# EasyEDA Pro project SimGEKI2_CardReader.epro

# Schematic CardReader
Board Name: CardReader; Create Date: 2023-11-30; Page Name: P1; Project Name: ongeki-controller; Schematic Name: CardReader; Update Date: 2025-03-11; Company: 嘉立创EDA; Page Size: A4; Version: v1.9
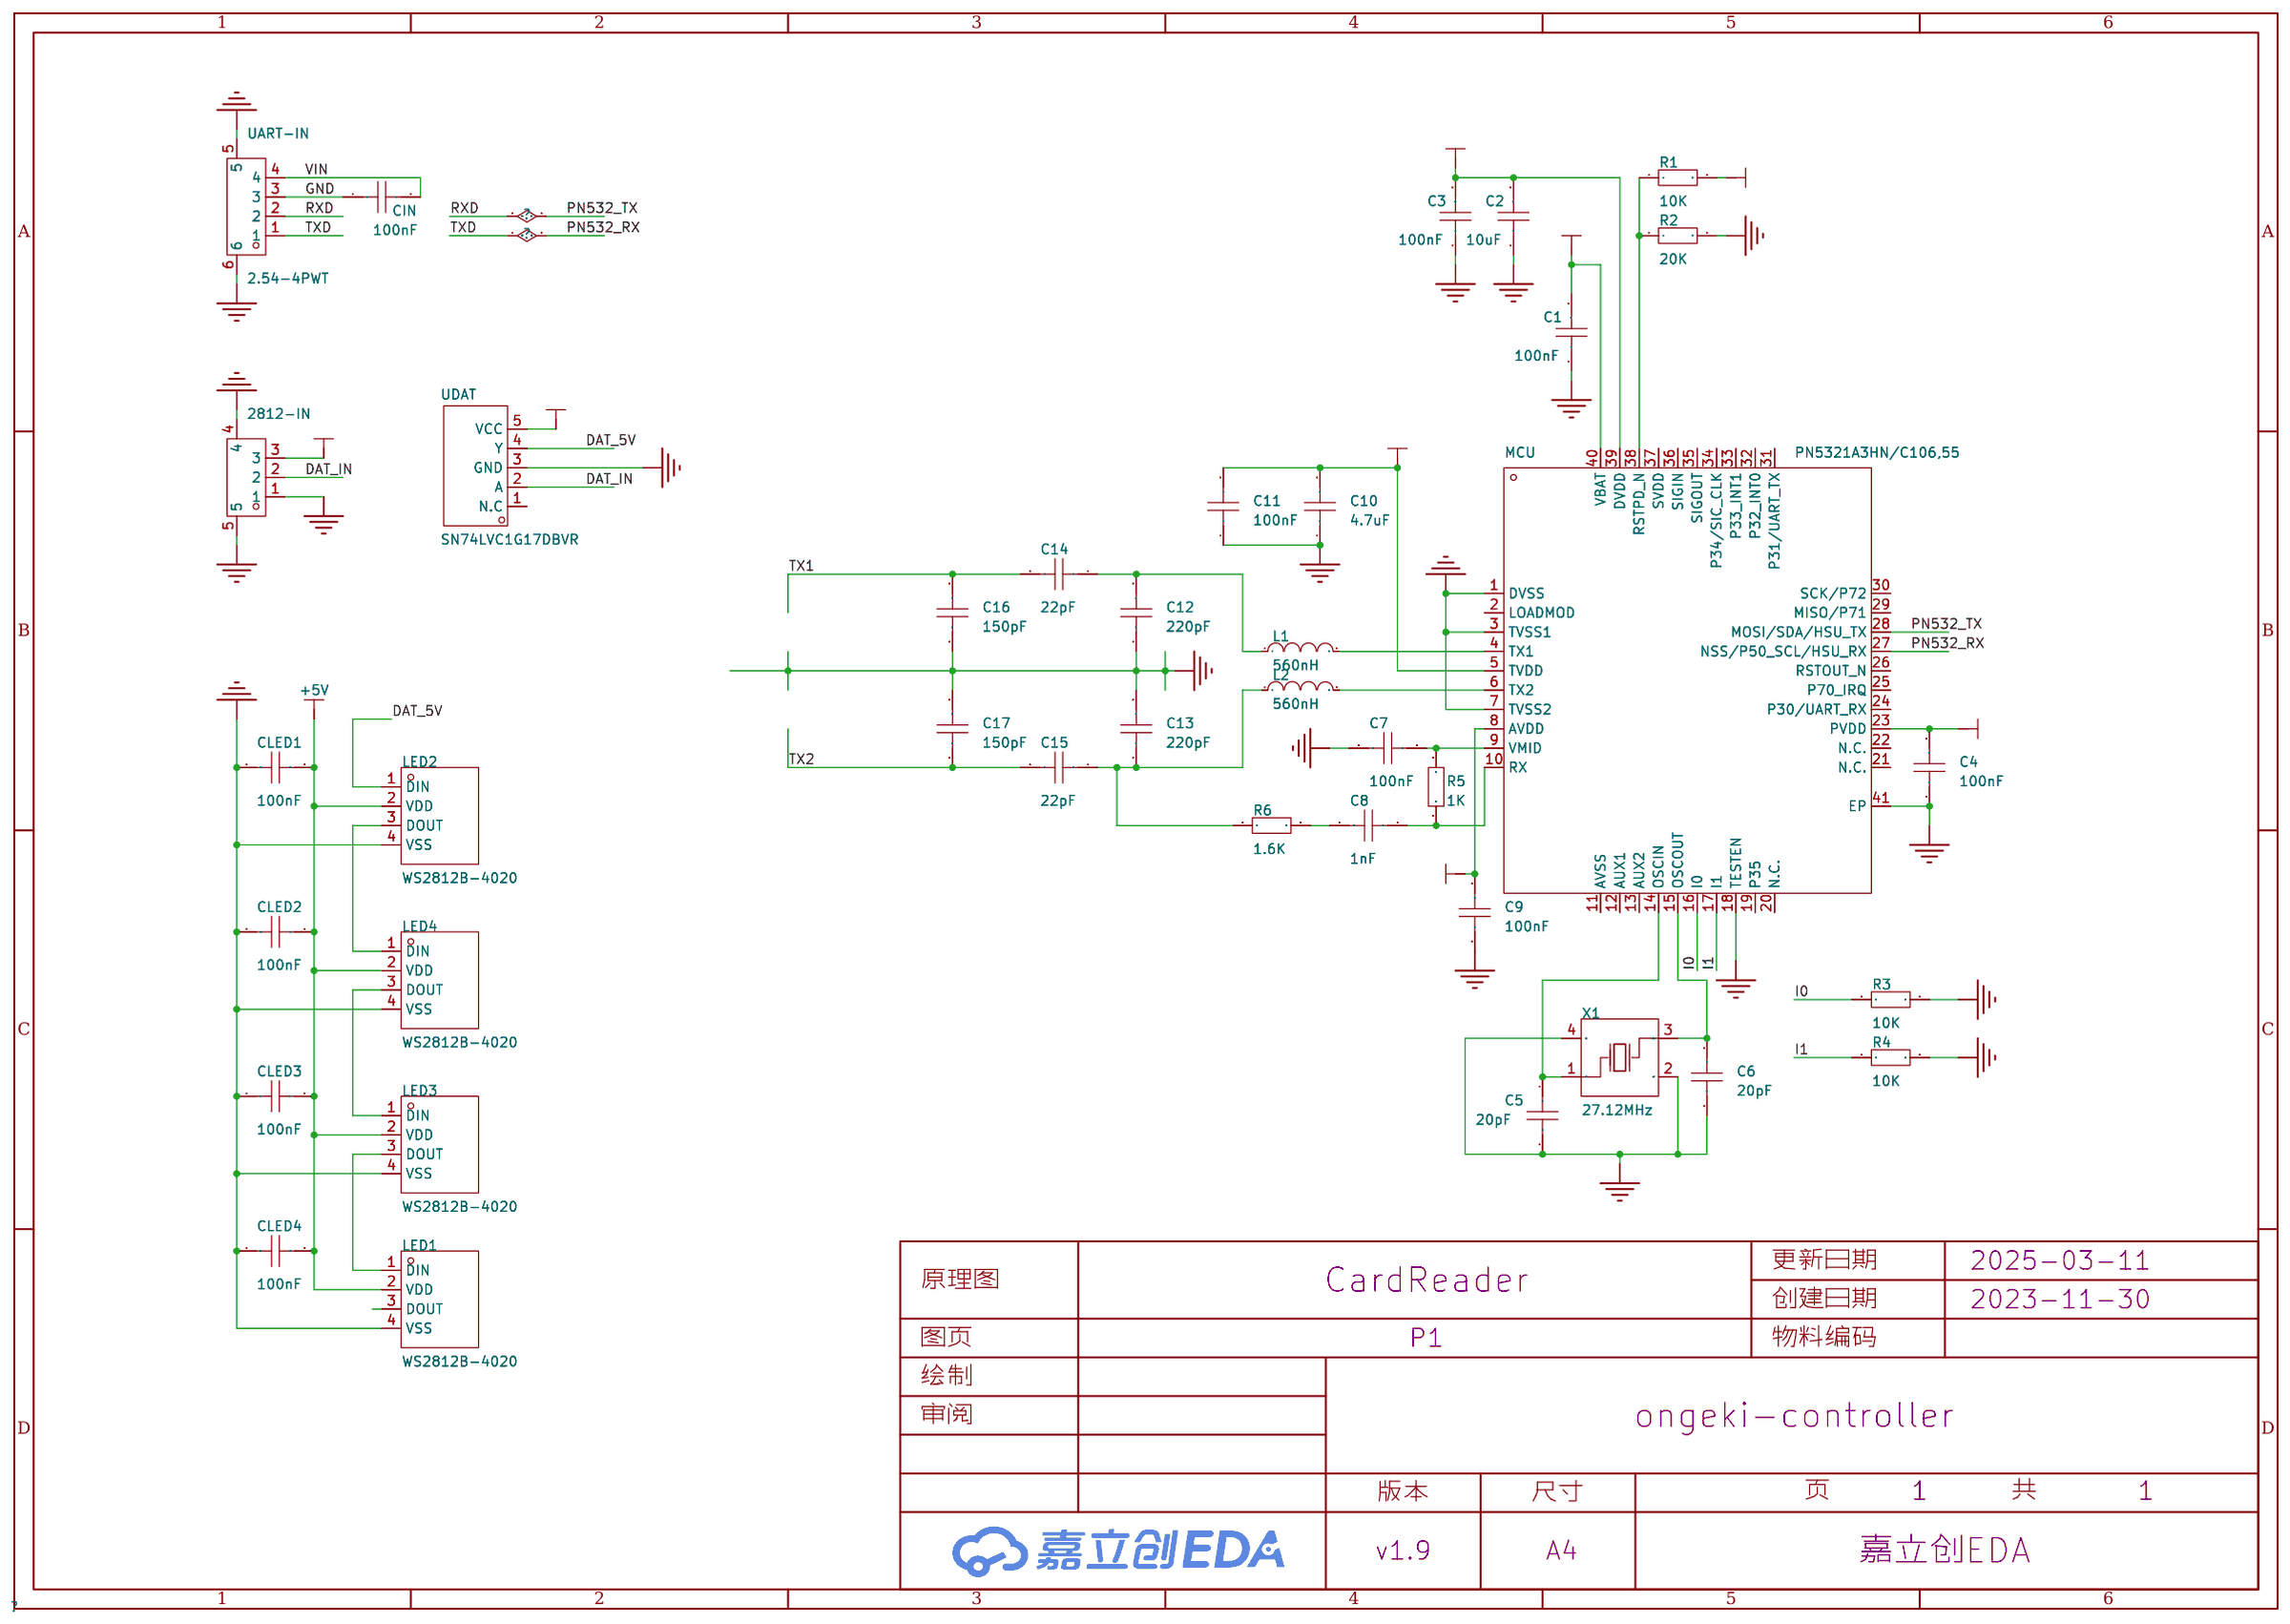
[diagram p0: schematic sheet]

## Parts
2812-IN  WAFER-PH2.0-3PWB  [CONN-SMD_3P-P2.00_XUNPU_WAFER-PH2.0-3PWB]
C1  100nF  [C0603]
C2  10uF  [C0603]
C3  100nF  [C0603]
C4  100nF  [C0603]
C5  20pF  [C0603]
C6  20pF  [C0603]
C7  100nF  [C0603]
C8  1nF  [C0603]
C9  100nF  [C0603]
C10  4.7uF  [C0603]
C11  100nF  [C0603]
C12  220pF  [C0603]
C13  220pF  [C0603]
C14  22pF  [C0603]
C15  22pF  [C0603]
C16  150pF  [C0603]
C17  150pF  [C0603]
CIN  100nF  [C0603]
CLED1  100nF  [C0603]
CLED2  100nF  [C0603]
CLED3  100nF  [C0603]
CLED4  100nF  [C0603]
L1  560nH  [L0603]
L2  560nH  [L0603]
LED1  WS2812B-4020  [LED-SMD_WS2812B-4020]
LED2  WS2812B-4020  [LED-SMD_WS2812B-4020]
LED3  WS2812B-4020  [LED-SMD_WS2812B-4020]
LED4  WS2812B-4020  [LED-SMD_WS2812B-4020]
MCU  PN5321A3HN/C106,55  [QFN-40_L6.0-W6.0-P0.50-BL-EP]
R1  10K  [R0603]
R2  20K  [R0603]
R3  10K  [R0603]
R4  10K  [R0603]
R5  1K  [R0603]
R6  1.6K  [R0603]
UART-IN  2.54-4PWT  [COMM-SMD_4P-P2.50_SHOUHAN_2.54-4PWT]
UDAT  SN74LVC1G17DBVR  [SOT-23-5_L3.0-W1.7-P0.95-LS2.8-BR]
X1  27.12MHz  [CRYSTAL-SMD_4P-L3.2-W2.5-BL]

## Library data of the parts
2812-IN = WAFER-PH2.0-3PWB: 插针结构:1x3P;间距:2mm;安装方式:卧贴;总PIN数:3P;排数:1;每排PIN数:3;额定电流:2A;工作温度范围:-25℃~+85℃;; LCSC Part Name: 1x3P 间距:2mm 卧贴; Supplier Part: C3029441; Manufacturer: XUNPU(讯普); Supplier Footprint: SMD,P=2mm,卧贴; JLCPCB Part Class: 扩展库; Datasheet: https://atta.szlcsc.com/upload/public/pdf/source/20220527/83903C18429EFE4C9EEE8C529A248431.pdf; Supplier: LCSC; Pins Structure: 1x3P; Pitch: 2mm; Mounting Style: 卧贴; Number of Pins: 3P; Number of Rows: 1; Number of PINs Per Row: 3; Current Rating (Max): 2A; Operating Temperature Range: -25℃~+85℃
C1-C17 CLED1-CLED4 = CAP_0603: Supplier Footprint: 0603
CIN = CC0603KRX7R9BB104: 容值:100nF;精度:±10%;额定电压:50V;材质(温度系数):X7R;; LCSC Part Name: 100nF ±10% 50V; Supplier Part: C14663; Manufacturer: YAGEO(国巨); Supplier Footprint: 0603; JLCPCB Part Class: Basic Part; Datasheet: https://atta.szlcsc.com/upload/public/pdf/source/20180910/C282072_33301C7F631E79921B82A8DAC6BCC5B3.pdf; Supplier: LCSC; Tolerance: ±10%; Voltage Rated: 50V; Temperature Coefficient: X7R
L1 L2 = L_0603
LED1-LED4 = WS2812B-4020: 侧发光，无需外围元器件，适用于鼠标，键盘，机箱风扇，差异化产品（注意防潮，请查阅规格书中对应具体内容）; LCSC Part Name: RGB三色; Supplier Part: C965557; Manufacturer: worldsemi; Supplier Footprint: SMD,2x4mm; JLCPCB Part Class: 扩展库; Datasheet: https://atta.szlcsc.com/upload/public/pdf/source/20201203/C965557_D4D919E14814D6BA44043987D39B5520.pdf; Supplier: LCSC
MCU = PN5321A3HN/C106,55: Supplier Part: C28925; Manufacturer: NXP(恩智浦); Supplier Footprint: QFN-40-EP(6x6); JLCPCB Part Class: 扩展库; Datasheet: https://atta.szlcsc.com/upload/public/pdf/source/20140322/1457707028102.pdf; Supplier: LCSC
R1-R6 = Res_0603: Supplier Footprint: 0603
UART-IN = 2.54-4PWT: 插针结构:1x4P;间距:2.5mm;公母:公;安装方式:卧贴;排数:1;每排PIN数:4;额定电流:3A;工作温度范围:-25℃~+85℃;; LCSC Part Name: 1x4P 间距:2.5mm 卧贴 2.54间距 4P卧贴; Supplier Part: C3008582; Manufacturer: SHOU HAN(首韩); Supplier Footprint: SMD,P=2.5mm; JLCPCB Part Class: Extended Part; Datasheet: https://atta.szlcsc.com/upload/public/pdf/source/20220427/2E7F20871E2A02EADA0277D3DA8C9F6A.pdf; Supplier: LCSC; Pins Structure: 1x4P; Pitch: 2.5mm; Gender: 公; Mounting Style: 卧贴; Number of Rows: 1; Number of PINs Per Row: 4; Current Rating (Max): 3A; Operating Temperature Range: -25℃~+85℃
UDAT = SN74LVC1G17DBVR: 输入类型:施密特触发器;电源电压:1.65V~5.5V;元件数:1;每个元件位数:1;灌电流(IOL):32mA;拉电流(IOH):32mA;; Supplier Part: C7836; Manufacturer: TI(德州仪器); Supplier Footprint: SOT-23-5; JLCPCB Part Class: 扩展库; Datasheet: https://www.ti.com/cn/lit/gpn/sn74lvc1g17; Supplier: LCSC; Input type: 施密特触发器; output type: 推挽; Supply Voltage: 1.65V~5.5V; Number of Elements: 1; Number of Bits per Element: 1; Sink Current: 32mA; Source Current: 32mA; Logic Family: 74LVC; Operating Temperature: -40℃~+125℃
X1 = X32252712MSB4SI: 晶振类型:贴片晶振;频率:27.12MHz;常温频差:±10ppm;外接负载电容:20pF;频率稳定度(全温):±20ppm;; LCSC Part Name: 27.12MHz ±10ppm 20pF; Supplier Part: C70591; Manufacturer: YXC(扬兴晶振); Supplier Footprint: SMD3225-4P; JLCPCB Part Class: 扩展库; Datasheet: https://atta.szlcsc.com/upload/public/pdf/source/20240329/19D5F850207469550BEB00D7DFEDBC7A.pdf; Supplier: LCSC; Crystal Type: 贴片晶振; Normal temperature Frequency Tolerance: ±10ppm; External load capacitor: 20pF; Frequency Stability(Full temperature range): ±20ppm; Operating Temperature: -40℃~+85℃

## Nets
+5V: 2812-IN.3 CLED1.2 CLED2.2 CLED3.2 CLED4.2 LED1.2(VDD) LED2.2(VDD) LED3.2(VDD) LED4.2(VDD) UDAT.5(VCC)
GND: 2812-IN.1 2812-IN.4 2812-IN.5 C1.1 C2.1 C3.1 C4.1 C5.2 C6.2 C7.1 C9.1 C10.1 C11.1 C12.1 C13.2 C16.1 C17.2 CIN.1 CLED1.1 CLED2.1 CLED3.1 CLED4.1 LED1.4(VSS) LED2.4(VSS) LED3.4(VSS) LED4.4(VSS) MCU.1(DVSS) MCU.3(TVSS1) MCU.7(TVSS2) MCU.18(TESTEN) MCU.41(EP) R2.2 R3.2 R4.2 UART-IN.3 UART-IN.5 UART-IN.6 UDAT.3(GND) X1.2(GND) X1.4(GND)
V33: C2.2 C3.2 C9.2 C10.2 C11.2 MCU.5(TVDD) MCU.8(AVDD) MCU.39(DVDD)
VIN: C1.2 C4.2 CIN.2 MCU.23(PVDD) MCU.40(VBAT) R1.2 UART-IN.4
DAT_5V: LED2.1(DIN) UDAT.4(Y)
DAT_IN: 2812-IN.2 UDAT.2(A)
I0: MCU.16(I0) R3.1
I1: MCU.17(I1) R4.1
PN532_RX: MCU.27(NSS/P50_SCL/HSU_RX) UART-IN.1
PN532_TX: MCU.28(MOSI/SDA/HSU_TX) UART-IN.2
TX1: C14.2 C16.2
TX2: C15.2 C17.1
$1N867: MCU.38(RSTPD_N) R1.1 R2.1
$1N1200: C5.1 MCU.14(OSCIN) X1.1(OSC1)
$1N1206: C6.1 MCU.15(OSCOUT) X1.3(OSC2)
$1N2378: C7.2 MCU.9(VMID) R5.2
$1N2510: C8.2 MCU.10(RX) R5.1
$1N2611: C8.1 R6.2
$1N2894: L1.2 MCU.4(TX1)
$1N2904: L2.2 MCU.6(TX2)
$1N3125: C13.1 C15.1 L2.1 R6.1
$1N3403: C12.2 C14.1 L1.1
$1N11608: LED1.1(DIN) LED3.3(DOUT)
$1N11620: LED3.1(DIN) LED4.3(DOUT)
$1N11630: LED2.3(DOUT) LED4.1(DIN)

Not connected (* = marked no-connect by the designer): LED1 3(DOUT); MCU 2(LOADMOD) 11(AVSS) 12(AUX1) 13(AUX2) 19(P35) 20(N.C.) 21(N.C.) 22(N.C.) 24(P30/UART_RX) 25(P70_IRQ) 26(RSTOUT_N) 29(MISO/P71) 30(SCK/P72) 31(P31/UART_TX) 32(P32_INT0) 33(P33_INT1) 34(P34/SIC_CLK) 35(SIGOUT) 36(SIGIN) 37(SVDD); UDAT 1(N.C)

# Board CardReader
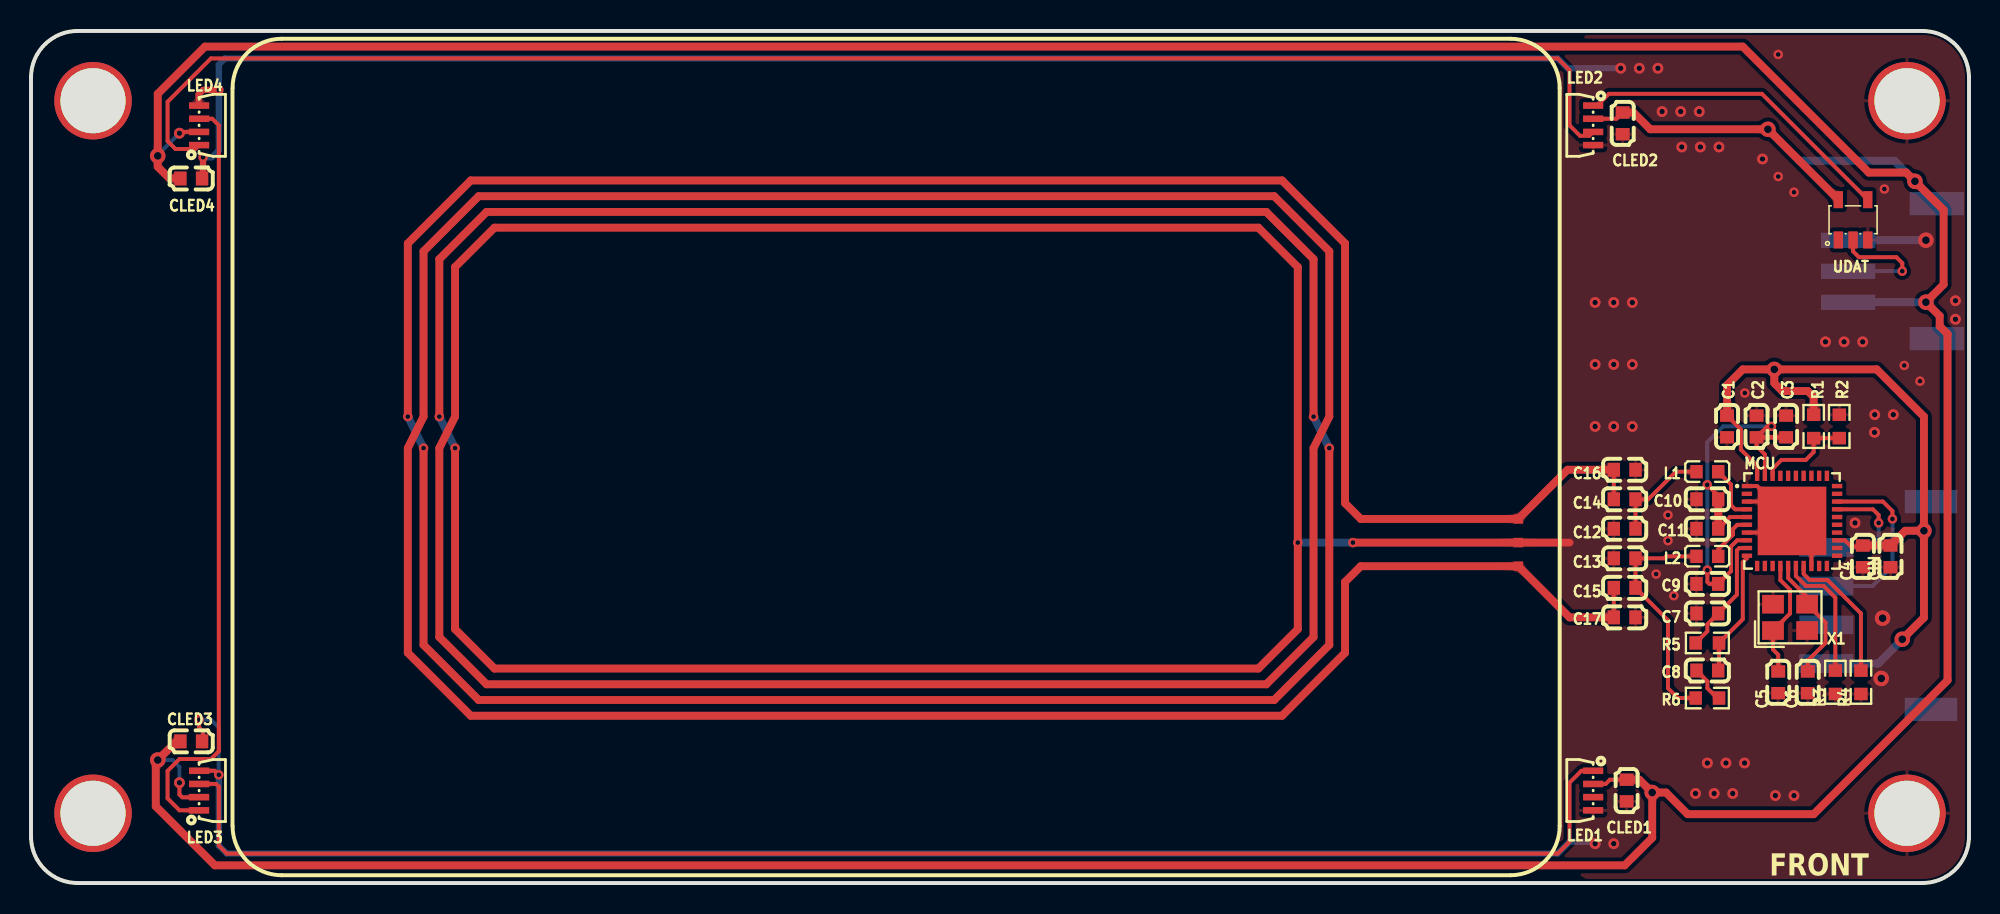
[diagram p1: board, top side]
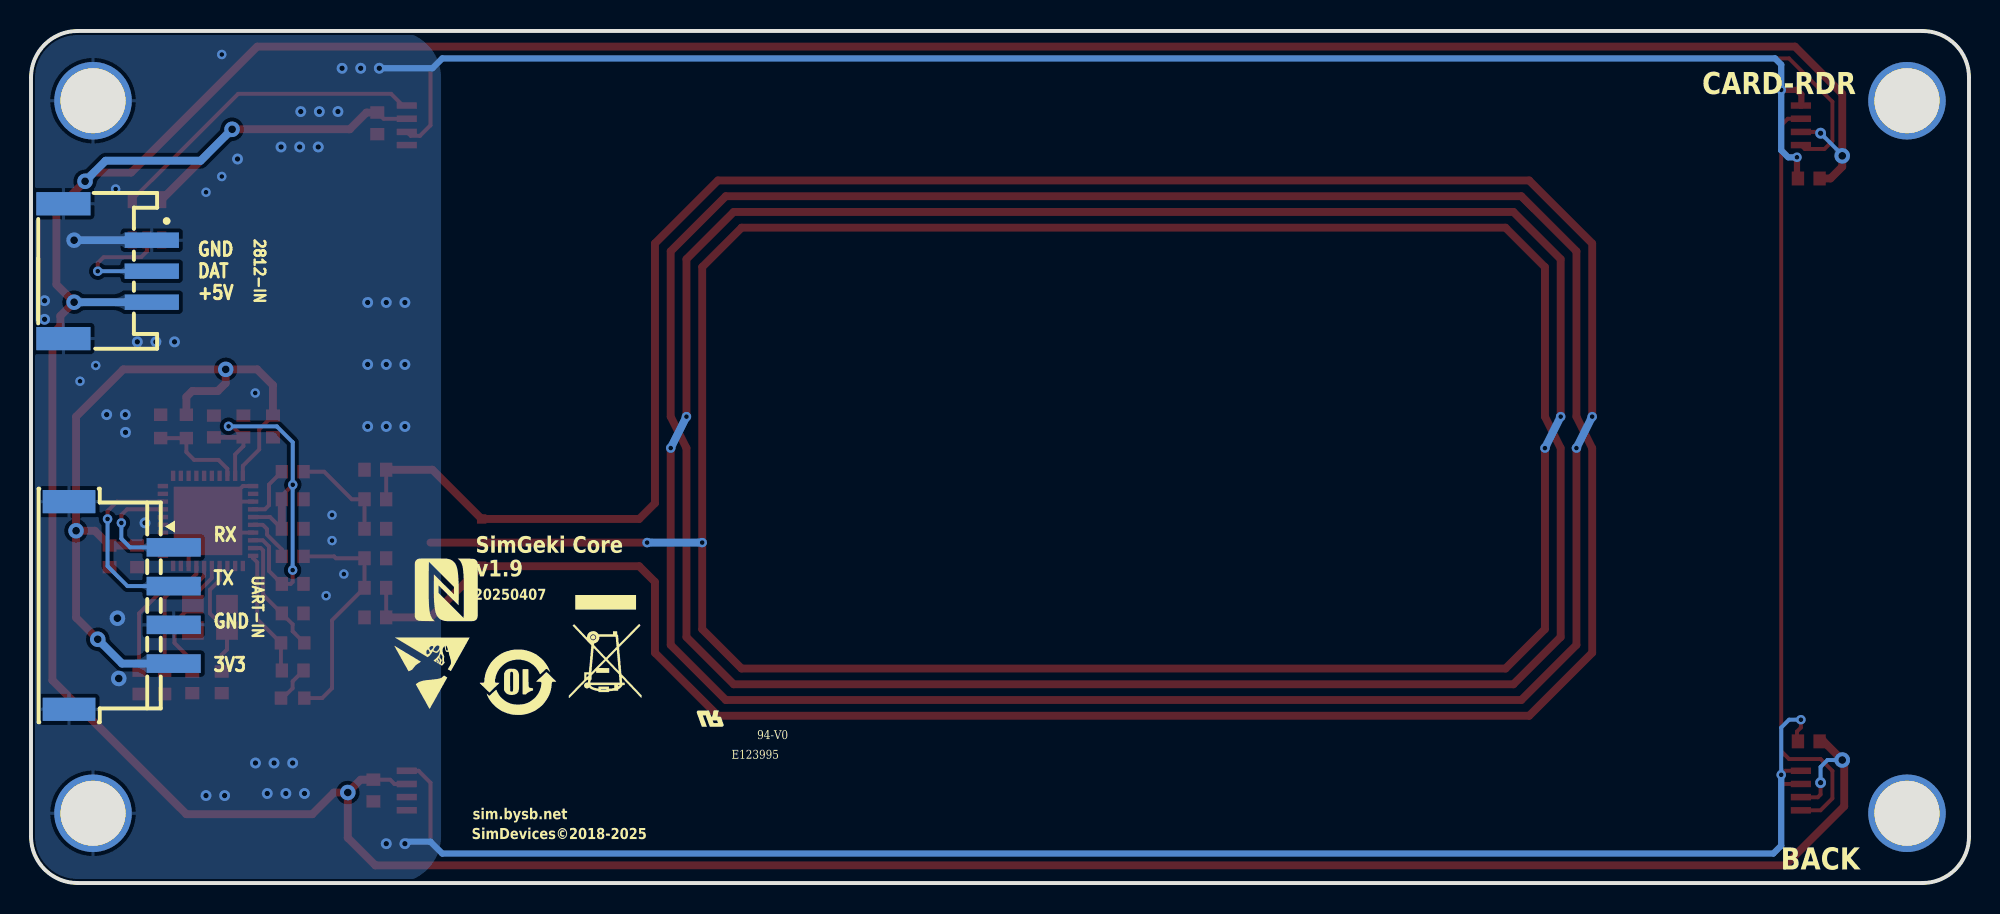
[diagram p2: board, bottom side, seen from below]

Outline 125 x 54.98 mm; copper layers: Top Layer, Bottom Layer. Coordinates in mm from the lower left corner of the outline.
Outline path: 0,51.98 0,3 arc(0.88,0.88) 3,0 122,0 arc(124.12,0.88) 125,3 125,51.98 arc(124.12,54.1) 122,54.98 3,54.98 arc(0.88,54.1) 0,51.98
Stack: Top Layer 0.035mm / Dielectric1 1.51mm FR4 er 4.5 / Bottom Layer 0.035mm

## Design rules (mm)
net TX1: TX
net TX2: TX
template: JLCPCB Capability(Two Layers Board)
spacing copperThickness1oz (default): track to track 0.102, other pairs 0.152 to 0.3
spacing copperThickness2oz: track to track 0.203, other pairs 0.152 to 0.3
track width copperThickness1oz (default): min 0.127, default 0.254, max 2.54
track width copperThickness2oz: min 0.203, default 0.254, max 2.54
differential pair differentialPair (default): width min 0.127, default 0.254, max 2.54; gap min 0.152, default 0.152
via viaSize (default): diameter min 0.5, default 0.61, max 10; hole min 0.3, default 0.305, max 6.3

## Placement (name value [footprint] x y rotation side)
2812-IN  WAFER-PH2.0-3PWB  [CONN-SMD_3P-P2.00_XUNPU_WAFER-PH2.0-3PWB]  120.06 39.48 270 bottom
C1  100nF  [C0603]  109.39 29.46 90 top
C2  10uF  [C0603]  111.3 29.46 270 top
C3  100nF  [C0603]  113.2 29.46 270 top
C4  100nF  [C0603]  118.16 21.08 90 top
C5  20pF  [C0603]  112.7 12.95 270 top
C6  20pF  [C0603]  114.6 12.95 270 top
C7  100nF  [C0603]  108.12 17.4 0 top
C8  1nF  [C0603]  108.12 13.71 0 top
C9  100nF  [C0603]  108.12 19.3 0 top
C10  4.7uF  [C0603]  108.12 24.76 0 top
C11  100nF  [C0603]  108.12 22.86 0 top
C12  220pF  [C0603]  102.79 22.86 0 top
C13  220pF  [C0603]  102.79 20.95 180 top
C14  22pF  [C0603]  102.79 24.76 180 top
C15  22pF  [C0603]  102.79 19.05 180 top
C16  150pF  [C0603]  102.79 26.67 180 top
C17  150pF  [C0603]  102.79 17.14 0 top
CIN  100nF  [C0603]  119.94 21.08 90 top
CLED1  100nF  [C0603]  102.92 5.97 90 top
CLED2  100nF  [C0603]  102.66 49.02 90 top
CLED3  100nF  [C0603]  10.33 9.14 180 top
CLED4  100nF  [C0603]  10.33 45.46 180 top
L1  560nH  [L0603]  108.12 26.54 0 top
L2  560nH  [L0603]  108.12 21.08 0 top
LED1  WS2812B-4020  [LED-SMD_WS2812B-4020]  100.76 5.97 90 top
LED2  WS2812B-4020  [LED-SMD_WS2812B-4020]  100.76 48.89 90 top
LED3  WS2812B-4020  [LED-SMD_WS2812B-4020]  10.84 5.97 270 top
LED4  WS2812B-4020  [LED-SMD_WS2812B-4020]  10.84 48.89 270 top
MCU  PN5321A3HN/C106,55  [QFN-40_L6.0-W6.0-P0.50-BL-EP]  113.59 23.36 270 top
NOREF  -  [Pad_e7191]  4 4.5 0 top
NOREF#2  -  [Pad_e7069]  4 50.48 0 top
NOREF#3  -  [Pad_e7860]  121 50.48 0 top
NOREF#4  -  [Pad_e568]  95.93 21.97 0 top
NOREF#5  -  [Pad_e317]  95.93 23.49 0 top
NOREF#6  -  [Pad_e305]  95.93 20.44 0 top
NOREF#7  -  [Pad_e8243]  121 4.5 0 top
R1  10K  [R0603]  114.98 29.46 90 top
R2  20K  [R0603]  116.63 29.46 90 top
R3  10K  [R0603]  116.38 12.95 270 top
R4  10K  [R0603]  118.03 12.95 270 top
R5  1K  [R0603]  108.12 15.49 180 top
R6  1.6K  [R0603]  108.12 11.93 0 top
UART-IN  2.54-4PWT  [COMM-SMD_4P-P2.50_SHOUHAN_2.54-4PWT]  119.17 17.91 270 bottom
UDAT  SN74LVC1G17DBVR  [SOT-23-5_L3.0-W1.7-P0.95-LS2.8-BR]  117.52 42.8 270 top
X1  27.12MHz  [CRYSTAL-SMD_4P-L3.2-W2.5-BL]  113.46 17.14 0 top

## Footprints (pads in the part's own frame, mm; a bottom-side part is the same pattern mirrored in y, then rotated)
C0603
  rect 0.8x0.9 smd: 1(-0.7,0) 2(0.7,0)
COMM-SMD_4P-P2.50_SHOUHAN_2.54-4PWT
  rect 1.2x3.5 smd: 1(-3.75,3.375) 2(-1.25,3.375) 3(1.25,3.375) 4(3.75,3.375)
  rect 1.5x3.4 smd: 5(6.7,-3.375) 6(-6.7,-3.375)
CONN-SMD_3P-P2.00_XUNPU_WAFER-PH2.0-3PWB
  rect 1x3.5 smd: 1(-2,2.85) 2(0,2.85) 3(2,2.85)
  rect 1.5x3.5 smd: 4(4.35,-2.85) 5(-4.35,-2.85)
CRYSTAL-SMD_4P-L3.2-W2.5-BL
  rect 1.4x1.2 smd: 1(-1.1,-0.85) 2(1.1,-0.85) 3(1.1,0.85) 4(-1.1,0.85)
L0603
  rect 0.8x0.864 smd: 1(-0.7,0) 2(0.7,0)
LED-SMD_WS2812B-4020
  rect 0.42x1.3 smd: 1(1.275,0) 2(0.425,0) 3(-0.425,0) 4(-1.275,0)
Pad_e305
  rect 0.61x0.61 smd: TP3(0,0)
Pad_e317
  rect 0.61x0.61 smd: TP1(0,0)
Pad_e568
  rect 0.61x0.61 smd: TP2(0,0)
Pad_e7069
  round 5 hole 4.2: 42(0,0)
Pad_e7191
  round 5 hole 4.2: 42(0,0)
Pad_e7860
  round 5 hole 4.2: 42(0,0)
Pad_e8243
  round 5 hole 4.2: 42(0,0)
QFN-40_L6.0-W6.0-P0.50-BL-EP
  rect 0.28x0.665 smd: 1(-2.25,-2.908) 2(-1.75,-2.908) 3(-1.25,-2.908) 4(-0.75,-2.908) 5(-0.25,-2.908) 6(0.25,-2.908) 7(0.75,-2.908) 8(1.25,-2.908) 9(1.75,-2.908) 10(2.25,-2.908) 21(2.25,2.908) 22(1.75,2.908) 23(1.25,2.908) 24(0.75,2.908) 25(0.25,2.908) 26(-0.25,2.908) 27(-0.75,2.908) 28(-1.25,2.908) 29(-1.75,2.908) 30(-2.25,2.908)
  rect 0.665x0.28 smd: 11(2.908,-2.25) 12(2.908,-1.75) 13(2.908,-1.25) 14(2.908,-0.75) 15(2.908,-0.25) 16(2.908,0.25) 17(2.908,0.75) 18(2.908,1.25) 19(2.908,1.75) 20(2.908,2.25) 31(-2.908,2.25) 32(-2.908,1.75) 33(-2.908,1.25) 34(-2.908,0.75) 35(-2.908,0.25) 36(-2.908,-0.25) 37(-2.908,-0.75) 38(-2.908,-1.25) 39(-2.908,-1.75) 40(-2.908,-2.25)
  rect 4.42x4.42 smd: 41(0,0)
R0603
  rect 0.806x0.864 smd: 1(-0.753,0) 2(0.753,0)
SOT-23-5_L3.0-W1.7-P0.95-LS2.8-BR
  rect 1.1x0.6 smd: 1(1.3,-0.95) 2(1.3,0) 3(1.3,0.95) 4(-1.3,0.95) 5(-1.3,-0.95)

## Nets
As in the schematic, except:
GND: 2812-IN.1 2812-IN.4 2812-IN.5 C1.1 C2.1 C3.1 C4.1 C5.2 C6.2 C7.1 C9.1 C10.1 C11.1 C12.1 C13.2 C16.1 C17.2 CIN.1 CLED1.1 CLED2.1 CLED3.1 CLED4.1 LED1.4 LED2.4 LED3.4 LED4.4 MCU.1 MCU.3 MCU.7 MCU.18 MCU.41 NOREF#3.42 NOREF#4.TP2 NOREF#7.42 R2.2 R3.2 R4.2 UART-IN.3 UART-IN.5 UART-IN.6 UDAT.3 X1.2 X1.4
TX1: C14.2 C16.2 NOREF#5.TP1
TX2: C15.2 C17.1 NOREF#6.TP3

Pads without a net: MCU 2 11 12 13 19 20 21 22 24 25 26 29 30 31 32 33 34 35 36 37; NOREF 42; NOREF#2 42; UDAT 1

## Via types
v1: diameter 0.7, hole 0.35, Top Layer to Bottom Layer, 40 vias
v2: diameter 0.61, hole 0.305, Top Layer to Bottom Layer, 29 vias
v3: diameter 1, hole 0.5, Top Layer to Bottom Layer, 12 vias

## Routing (per net, layer and track width the routed paths; a pad name or vN(x,y) marks a point on that pad's centre or on a via; arc(x,y) is an arc through that point)
+5V: length 335.2
  Top Layer w0.254: CLED1.2 101.84,6.67 101.56,6.39 LED1.2 ; CLED2.2 102.26,49.32 LED2.2 ; LED3.2 10.83,5.53 9.75,5.53 9.57,5.71 v1(9.57,6.47) ; LED4.2 9.66,48.47 v1(9.57,48.38)
  Top Layer w0.508: CLED1.2 103.74,6.67 v3(104.57,5.84) ; v3(104.57,5.84) 105.46,5.84 106.85,4.44 114.98,4.44 123.62,13.08 123.62,35.43 123.11,35.94 123.11,36.59 v3(122.22,37.48) 123.36,38.62 123.36,43.43 v3(121.51,45.28) 120.95,45.84 118.54,45.84 110.41,53.97 11.22,53.97 8.17,50.92 v3(8.17,46.92) 8.17,46.22 8.94,45.46 CLED4.2 ; v3(104.57,5.84) 104.57,2.92 102.79,1.14 11.86,1.14 8.05,4.95 8.05,7.81 v3(8.17,7.94) 9.38,9.14 CLED3.2 ; UDAT.5 v3(112.03,48.64) 104.44,48.64 103.36,49.72 CLED2.2
  Bottom Layer w0.254: v1(9.57,48.38) 8.17,46.99 v3(8.17,46.92) ; v3(8.17,7.94) 9.13,7.94 9.57,7.49 v1(9.57,6.47)
  Bottom Layer w0.508: v3(121.51,45.28) 120.19,46.61 114.06,46.61 v3(112.03,48.64) ; 2812-IN.3 v3(122.22,37.48)
GND: length 237.2
  Top Layer w0.254: v2(10.84,10.54) 10.84,10.03 11.1,9.78 11.1,9.2 CLED3.1 ; MCU.18 114.84,22.11 MCU.41 ; MCU.41 112.84,22.61 MCU.7 ; MCU.41 112.34,24.61 ; MCU.3 112.34,24.61 ; 112.34,24.61 111.34,25.61 MCU.1 ; v2(12.11,6.98) 11.85,7.24 LED3.4
  Top Layer w0.4: v2(12.11,51.18) 11.1,51.18 10.81,50.89 10.81,50.2 LED4.4 ; v2(11.1,46.83) 11.1,45.52 CLED4.1
  Top Layer w0.508: v2(85.26,21.97) NOREF#4.TP2 99.23,21.97
  Bottom Layer w0.254: v2(12.11,6.98) 12.11,10.03 11.6,10.54 v2(10.84,10.54)
  Bottom Layer w0.4: v1(102.54,52.57) 99.11,52.57 98.47,53.21 12.51,53.21 12.11,52.81 v2(12.11,51.18) 12.11,47.28 11.66,46.83 v2(11.1,46.83) ; v1(100.88,2.54) 100.76,2.66 99.23,2.66 98.47,1.9 12.62,1.9 12.11,2.41 v2(12.11,6.98)
  Bottom Layer w0.508: 2812-IN.1 v3(122.22,41.48) ; v2(81.71,21.97) v2(85.26,21.97)
  vias: v1(100.88,37.46) v1(100.88,33.46) v1(100.88,29.46) v1(102.09,37.46) v1(102.09,33.46) v1(102.09,29.46) v1(102.09,2.54) v1(103.28,37.46) v1(103.28,33.46) v1(103.28,29.46) v1(103.74,52.57) v1(104.94,52.57) v1(105.2,49.78) v1(106.4,49.78) v1(106.47,47.49) v1(107.36,5.78) v1(107.6,49.78) v1(107.67,47.49) v1(108.12,7.74) v1(108.56,5.78) v1(108.87,47.49) v1(109.32,7.74) v1(109.76,5.78) v1(110.52,7.74) v1(111.68,46.72) v1(112.51,5.64) v1(113.71,5.64) v1(115.74,34.92) v1(116.94,34.92) v1(117.65,23.24) v1(118.14,34.92) v1(118.92,30.22) v1(118.91,29.08) v1(120.12,30.22) v1(124.13,37.58) v1(124.13,36.38) v2(104.82,19.94) v2(105.58,23.75) v2(105.58,22.09) v2(105.97,18.54) v2(110.54,31.62) v2(112.7,53.46) v2(112.7,45.59) v2(113.71,44.57) v2(119.54,44.78) v2(120.82,33.4) v2(121.84,32.38) v3(119.34,13.2) v3(119.43,17.09)
V33: length 29.5
  Top Layer w0.254: v2(108.12,25.7) 108.82,24.99 C10.2 ; v2(112.26,29.47) 112.01,29.47 C2.2 111.3,28.19 111.84,27.65 MCU.39 ; C11.2 109.58,23.61 MCU.5 ; MCU.8 110.05,22.11 109.65,21.71 109.65,20.12 C9.2 108.25,19.3 108.12,19.43 v2(108.12,20.19)
  Top Layer w0.305: C2.2 C3.2
  Top Layer w0.508: C10.2 C11.2
  Bottom Layer w0.254: 108.12,20.19 108.12,25.69 v2(108.12,25.7) 108.12,28.44 109.15,29.47 v2(112.26,29.47)
VIN: length 52.7
  Top Layer w0.254: MCU.40 111.34,26.92 110.28,27.97 110.28,29.27 C1.2 ; C4.2 118.09,21.71 117.4,21.71 116.99,22.11 MCU.23
  Top Layer w0.508: v3(122.09,22.73) 122.09,17.13 v3(120.7,15.73) ; v3(122.09,22.73) 120.89,22.73 CIN.2 C4.2 ; v3(122.09,22.73) 122.09,30.1 119.05,33.14 v3(112.44,33.14) ; v3(112.44,33.14) 110.41,33.14 109.39,32.13 C1.2 ; v3(112.44,33.14) 112.44,32.25 112.95,31.75 114.6,31.75 114.98,31.37 R1.2
  Bottom Layer w0.508: UART-IN.4 119.13,14.16 v3(120.7,15.73)
DAT_5V: length 20.9
  Top Layer w0.254: UDAT.4 111.64,50.92 101.77,50.92 101.02,50.17 LED2.1
DAT_IN: length 8.2
  Top Layer w0.254: v2(120.7,39.48) 120.7,40 120.32,40.38 117.9,40.38 117.52,40.76 UDAT.2
  Bottom Layer w0.254: 2812-IN.2 v2(120.7,39.48)
I0: length 8.5
  Top Layer w0.254: MCU.16 113.84,19.81 114.47,19.17 115.62,19.17 116.38,18.41 R3.1
I1: length 9
  Top Layer w0.254: R4.1 118.03,17.4 115.87,19.55 114.73,19.55 114.34,19.95 MCU.17
PN532_RX: length 8
  Top Layer w0.254: v2(119.17,23.24) 119.17,23.75 118.8,24.11 MCU.27
  Bottom Layer w0.254: UART-IN.1 118.61,21.66 119.17,22.22 v2(119.17,23.24)
PN532_TX: length 12.2
  Top Layer w0.254: v2(120.06,23.49) 120.06,24 119.45,24.61 MCU.28
  Bottom Layer w0.254: v2(120.06,23.49) 120.06,20.44 118.78,19.16 UART-IN.2
TX1: length 359.3
  Top Layer w0.254: C16.2 C14.2
  Top Layer w0.508: v2(25.32,28.06) 25.32,15.36 28.88,11.81 80.18,11.81 83.74,15.36 v2(83.74,28.06) ; C16.2 99.11,26.67 NOREF#5.TP1 85.77,23.49 84.76,24.51 84.76,41.27 80.69,45.34 28.37,45.34 24.3,41.27 v2(24.3,30.1) ; 81.71,21.97 81.71,16.38 79.17,13.84 29.89,13.84 27.35,16.38 v2(27.35,28.06) ; v2(26.34,30.1) 26.34,40.26 29.38,43.3 79.68,43.3 82.72,40.26 v2(82.72,30.1)
  Bottom Layer w0.508: v2(26.34,30.1) v2(27.35,28.06) ; v2(24.3,30.1) v2(25.32,28.06) ; v2(82.72,30.1) v2(83.74,28.06)
TX2: length 359.3
  Top Layer w0.254: C17.1 C15.2
  Top Layer w0.508: C17.1 99.23,17.14 NOREF#6.TP3 85.77,20.44 84.76,19.43 84.76,14.86 80.69,10.79 28.37,10.79 24.3,14.86 24.3,28.06 25.32,30.1 25.32,40.76 28.88,44.32 80.18,44.32 83.74,40.76 83.74,30.1 82.72,28.06 82.72,15.87 79.68,12.82 29.38,12.82 26.34,15.87 26.34,28.06 27.35,30.1 27.35,39.75 29.89,42.29 79.17,42.29 81.71,39.75 81.71,21.97
$1N867: length 6.1
  Top Layer w0.254: MCU.38 112.34,26.73 112.91,27.3 114.47,27.3 114.98,27.81 R1.1 R2.1
$1N1200: length 7.7
  Top Layer w0.254: MCU.14 112.84,19.54 113.46,18.92 113.46,17.39 X1.1 112.36,15.07 112.7,14.73 C5.1
$1N1206: length 8.3
  Top Layer w0.254: C6.1 114.6,14.35 115.74,15.49 115.74,16.81 X1.3 114.56,18.45 113.34,19.68 MCU.15
$1N2378: length 7.8
  Top Layer w0.254: R5.2 108.12,16.24 108.12,16.7 C7.2 110.03,18.6 110.03,21.46 110.18,21.61 MCU.9
$1N2510: length 8.2
  Top Layer w0.254: C8.2 108.88,13.77 R5.1 110.41,17.02 110.41,20.7 110.68,20.97 MCU.10
$1N2611: length 2.4
  Top Layer w0.254: C8.1 108.12,13.01 108.12,12.57 108.76,11.93 R6.2
$1N2894: length 3.6
  Top Layer w0.254: MCU.4 109.91,24.11 109.65,24.38 109.65,25.72 L1.2
$1N2904: length 3.2
  Top Layer w0.254: L2.2 108.82,21.52 109.78,22.48 109.78,22.83 110.05,23.11 110.67,23.11 MCU.6
$1N3125: length 15.3
  Top Layer w0.254: R6.1 106.22,11.93 105.58,12.57 105.58,16.95 C15.1 C13.1 105.33,20.95 105.46,21.08 L2.1
$1N3403: length 6.6
  Top Layer w0.254: C12.2 C14.1 104.31,24.76 106.09,26.54 L1.1
$1N11608: length 98.5
  Top Layer w0.254: LED1.1 100,7.24 99.23,6.47 99.23,2.66 98.47,1.9 12.62,1.9 12.11,2.41 12.11,6.22 11.94,6.39 LED3.3
$1N11620: length 49.8
  Top Layer w0.254: LED4.3 11.69,49.32 12.11,48.89 12.11,8.51 11.6,8 9.57,8 8.81,7.24 8.81,5.46 9.58,4.69 10.84,4.69
$1N11630: length 102.2
  Top Layer w0.254: LED2.3 100.5,48.21 99.91,48.21 99.23,48.89 99.23,52.45 98.47,53.21 11.6,53.21 8.81,50.42 8.81,47.88 9.32,47.37 10.59,47.37 LED4.1

## Copper pours and planes (outline as drawn; the poured copper is in the pictures)
GND on Top Layer: 98.55,51.98 98.56,52.24 98.61,52.59 98.7,52.92 98.83,53.25 99,53.55 99.2,53.84 99.43,54.1 99.69,54.33 99.98,54.53 100.28,54.7 100.61,54.83 100.95,54.92 101.29,54.97 101.55,54.98 122,54.98 122.26,54.97 122.61,54.92 122.94,54.83 123.27,54.7 123.57,54.53 123.86,54.33 124.12,54.1 124.35,53.84 124.55,53.55 124.72,53.25 124.85,52.92 124.94,52.59 124.99,52.24 125,51.98 125,3 124.99,2.74 124.94,2.39 124.85,2.06 124.72,1.73 124.55,1.43 124.35,1.14 124.12,0.88 123.86,0.65 123.57,0.45 123.27,0.28 122.94,0.15 122.61,0.06 122.26,0.01 122,0 101.55,0 101.29,0.01 100.95,0.06 100.61,0.15 100.28,0.28 99.98,0.45 99.69,0.65 99.43,0.88 99.2,1.14 99,1.43 98.83,1.73 98.7,2.06 98.61,2.39 98.56,2.74 98.55,3
GND on Bottom Layer: 98.55,51.98 98.56,52.24 98.61,52.59 98.7,52.92 98.83,53.25 99,53.55 99.2,53.84 99.43,54.1 99.69,54.33 99.98,54.53 100.28,54.7 100.61,54.83 100.95,54.92 101.29,54.97 101.55,54.98 122,54.98 122.26,54.97 122.61,54.92 122.94,54.83 123.27,54.7 123.57,54.53 123.86,54.33 124.12,54.1 124.35,53.84 124.55,53.55 124.72,53.25 124.85,52.92 124.94,52.59 124.99,52.24 125,51.98 125,3 124.99,2.74 124.94,2.39 124.85,2.06 124.72,1.73 124.55,1.43 124.35,1.14 124.12,0.88 123.86,0.65 123.57,0.45 123.27,0.28 122.94,0.15 122.61,0.06 122.26,0.01 122,0 101.55,0 101.29,0.01 100.95,0.06 100.61,0.15 100.28,0.28 99.98,0.45 99.69,0.65 99.43,0.88 99.2,1.14 99,1.43 98.83,1.73 98.7,2.06 98.61,2.39 98.56,2.74 98.55,3

Small or netless copper shapes (teardrops, artwork), in the pictures only: 144 on Top Layer, 38 on Bottom Layer

## Text on the board
Bottom Silkscreen Layer: RX / TX / GND / 3V3 | GND / DAT / +5V | 20250407 | sim.bysb.net | SimDevices©2018-2025 | SimGeki Core | v1.9 | BACK | CARD-RDR | 94-V0 | E123995
Top Solder Mask Layer: CardReader | SimGeki
Top Silkscreen Layer: JLCJLCJLCJLC | FRONT
